# EAGLE board LEDSubMatrixHighDensity_test (EAGLE 9.6.2)
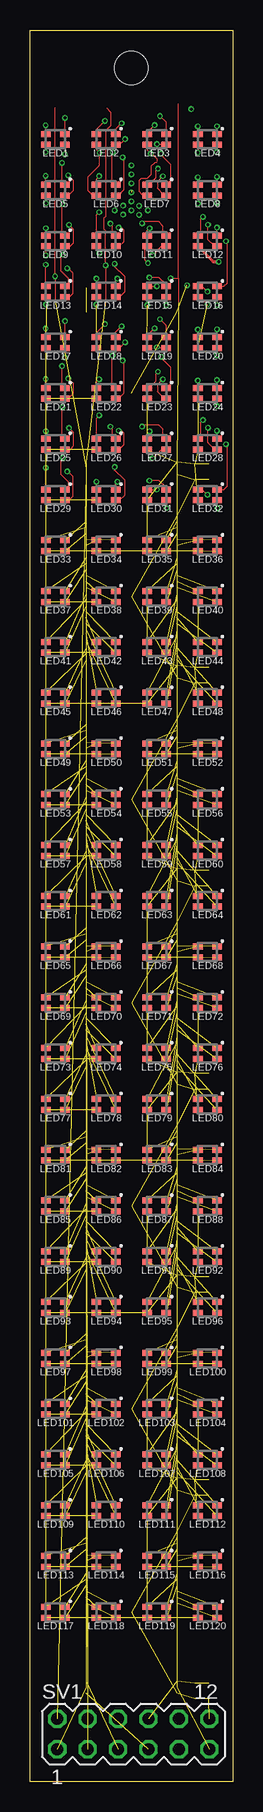
[diagram p2: board, top side]
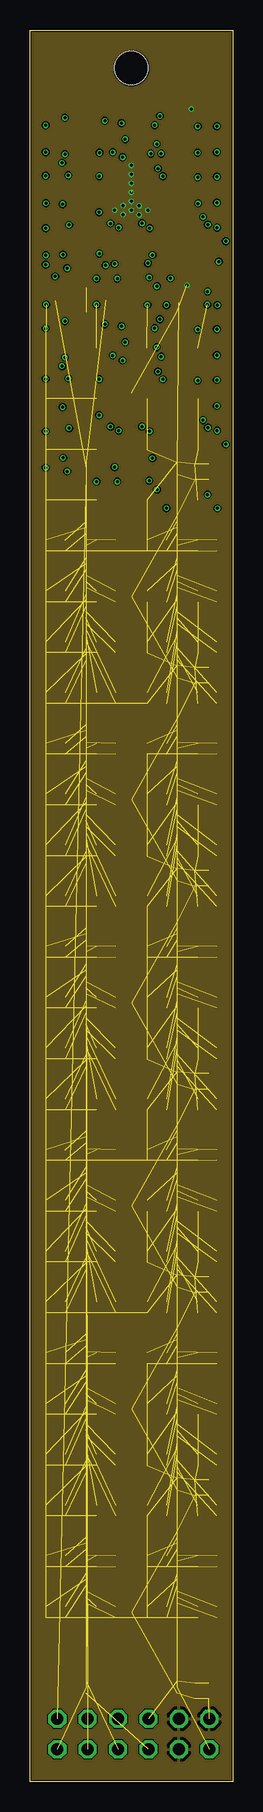
[diagram p3: board, inner layer InnerTop]
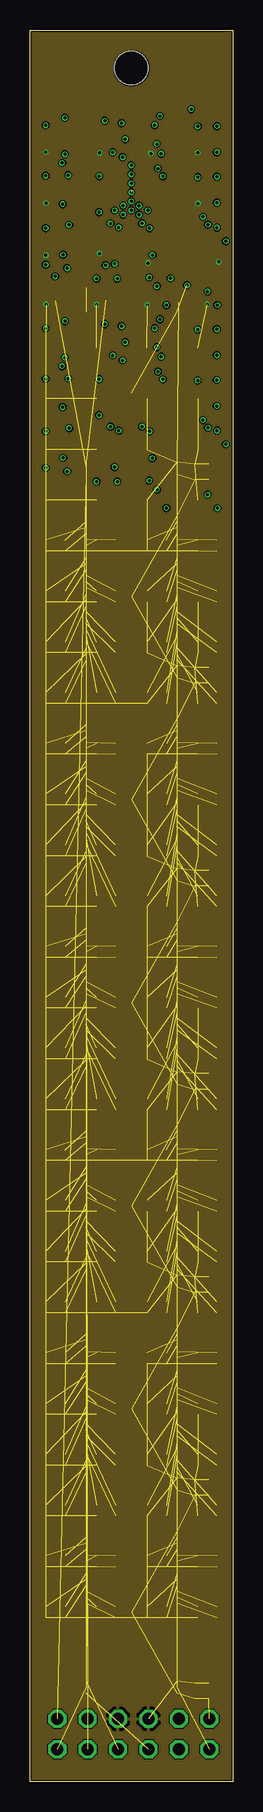
[diagram p4: board, inner layer InnerBottom]
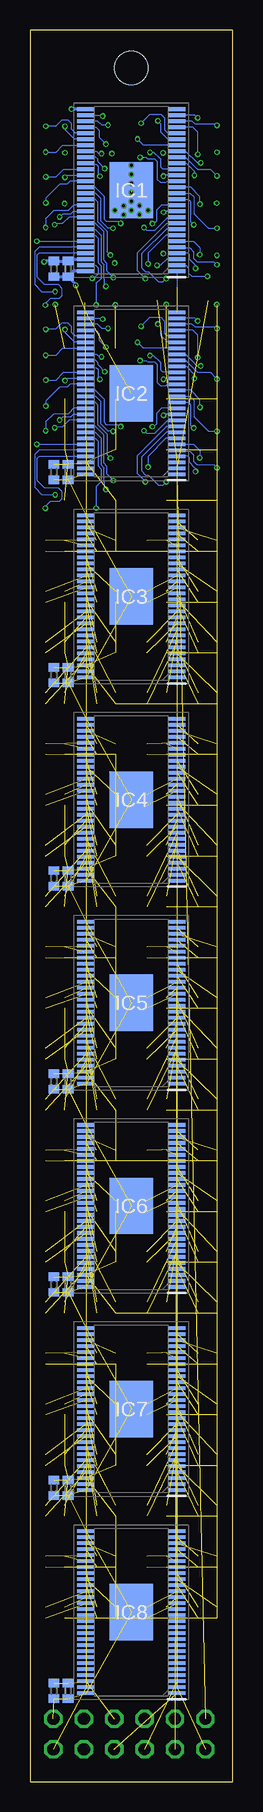
[diagram p5: board, bottom side, seen from below]

Size 16.93 x 146 mm. Coordinates in mm from the lower left corner, seen from the top.
Outline: 0,146 16.93,146 16.93,0 0,0 0,146
Copper layers (1+2*15+16): Top 0.035mm / dielectric 0.2mm / InnerTop 0.0175mm / dielectric 1.065mm / InnerBottom 0.0175mm / dielectric 0.2mm / Bottom 0.035mm
Design rules "jlcpcb_4layer_1oz *": minimum track width 4mil, minimum drill 0.2mm, track to track 4mil, track to pad 0.2mm, pad to pad 5mil, via to via 6mil, smd to smd 5mil, copper to edge 5mil, drill to drill 0.5mm, minimum pad ring 10mil, minimum via ring 0.1mm, stop-mask expansion 4mil, vias tented up to drill 0mil, thermal gap 10mil
Holes 2.75 mm at 8.47,142.82

## Footprints (pad centres in the part's own frame; a part is rotated, then mirrored left to right if it is on the bottom)
C0402 = smd 0.7 x 0.9: 1 -0.65,0; 2 0.65,0
SOP50P810X120-57N = smd 1.475 x 0.3: 1 -3.788,6.75; 2 -3.788,6.25; 3 -3.788,5.75; 4 -3.788,5.25; 5 -3.788,4.75; 6 -3.788,4.25; 7 -3.788,3.75; 8 -3.788,3.25; 9 -3.788,2.75; 10 -3.788,2.25; 11 -3.788,1.75; 12 -3.788,1.25; 13 -3.788,0.75; 14 -3.788,0.25; 15 -3.788,-0.25; 16 -3.788,-0.75; 17 -3.788,-1.25; 18 -3.788,-1.75; 19 -3.788,-2.25; 20 -3.788,-2.75; 21 -3.788,-3.25; 22 -3.788,-3.75; 23 -3.788,-4.25; 24 -3.788,-4.75; 25 -3.788,-5.25; 26 -3.788,-5.75; 27 -3.788,-6.25; 28 -3.788,-6.75; 29 3.788,-6.75; 30 3.788,-6.25; 31 3.788,-5.75; 32 3.788,-5.25; 33 3.788,-4.75; 34 3.788,-4.25; 35 3.788,-3.75; 36 3.788,-3.25; 37 3.788,-2.75; 38 3.788,-2.25; 39 3.788,-1.75; 40 3.788,-1.25; 41 3.788,-0.75; 42 3.788,-0.25; 43 3.788,0.25; 44 3.788,0.75; 45 3.788,1.25; 46 3.788,1.75; 47 3.788,2.25; 48 3.788,2.75; 49 3.788,3.25; 50 3.788,3.75; 51 3.788,4.25; 52 3.788,4.75; 53 3.788,5.25; 54 3.788,5.75; 55 3.788,6.25; 56 3.788,6.75 | smd 3.61 x 4.7: 57 0,0
B38G3RGB = smd 0.8 x 0.5: 1 0.8,0.45; 2 0.8,-0.45; 3 -0.8,-0.45; 4 -0.8,0.45
MA06-2 = drill 1.016 octagon: 1 -6.35,-1.27; 2 -6.35,1.27; 3 -3.81,-1.27; 4 -3.81,1.27; 5 -1.27,-1.27; 6 -1.27,1.27; 7 1.27,-1.27; 8 1.27,1.27; 9 3.81,-1.27; 10 3.81,1.27; 11 6.35,-1.27; 12 6.35,1.27

## Placement (x,y rotation side)
C1  .1uF  [C0402]  13.75,126.09 270 bottom
C1B  10uF  [C0402]  14.93,126.09 270 bottom
C2  .1uF  [C0402]  13.75,109.16 270 bottom
C2B  10uF  [C0402]  14.93,109.16 270 bottom
C3  .1uF  [C0402]  13.75,92.22 270 bottom
C3B  10uF  [C0402]  14.93,92.22 270 bottom
C4  .1uF  [C0402]  13.75,75.29 270 bottom
C4B  10uF  [C0402]  14.93,75.29 270 bottom
C5  .1uF  [C0402]  13.75,58.36 270 bottom
C5B  10uF  [C0402]  14.93,58.36 270 bottom
C6  .1uF  [C0402]  13.75,41.42 270 bottom
C6B  10uF  [C0402]  14.93,41.42 270 bottom
C7  .1uF  [C0402]  13.75,24.49 270 bottom
C7B  10uF  [C0402]  14.93,24.49 270 bottom
C8  .1uF  [C0402]  13.75,7.56 270 bottom
C8B  10uF  [C0402]  14.93,7.56 270 bottom
IC1  TLC5955DCAR  [SOP50P810X120-57N]  8.47,132.65 180 bottom
IC2  TLC5955DCAR  [SOP50P810X120-57N]  8.47,115.72 180 bottom
IC3  TLC5955DCAR  [SOP50P810X120-57N]  8.47,98.78 180 bottom
IC4  TLC5955DCAR  [SOP50P810X120-57N]  8.47,81.85 180 bottom
IC5  TLC5955DCAR  [SOP50P810X120-57N]  8.47,64.92 180 bottom
IC6  TLC5955DCAR  [SOP50P810X120-57N]  8.47,47.98 180 bottom
IC7  TLC5955DCAR  [SOP50P810X120-57N]  8.47,31.05 180 bottom
IC8  TLC5955DCAR  [SOP50P810X120-57N]  8.47,14.12 180 bottom
LED1  B38G3RGB  [B38G3RGB]  2.12,136.88 0 top
LED2  B38G3RGB  [B38G3RGB]  6.35,136.88 0 top
LED3  B38G3RGB  [B38G3RGB]  10.58,136.88 0 top
LED4  B38G3RGB  [B38G3RGB]  14.82,136.88 0 top
LED5  B38G3RGB  [B38G3RGB]  2.12,132.65 0 top
LED6  B38G3RGB  [B38G3RGB]  6.35,132.65 0 top
LED7  B38G3RGB  [B38G3RGB]  10.58,132.65 0 top
LED8  B38G3RGB  [B38G3RGB]  14.82,132.65 0 top
LED9  B38G3RGB  [B38G3RGB]  2.12,128.42 0 top
LED10  B38G3RGB  [B38G3RGB]  6.35,128.42 0 top
LED11  B38G3RGB  [B38G3RGB]  10.58,128.42 0 top
LED12  B38G3RGB  [B38G3RGB]  14.82,128.42 0 top
LED13  B38G3RGB  [B38G3RGB]  2.12,124.18 0 top
LED14  B38G3RGB  [B38G3RGB]  6.35,124.18 0 top
LED15  B38G3RGB  [B38G3RGB]  10.58,124.18 0 top
LED16  B38G3RGB  [B38G3RGB]  14.82,124.18 0 top
LED17  B38G3RGB  [B38G3RGB]  2.12,119.95 0 top
LED18  B38G3RGB  [B38G3RGB]  6.35,119.95 0 top
LED19  B38G3RGB  [B38G3RGB]  10.58,119.95 0 top
LED20  B38G3RGB  [B38G3RGB]  14.82,119.95 0 top
LED21  B38G3RGB  [B38G3RGB]  2.12,115.72 0 top
LED22  B38G3RGB  [B38G3RGB]  6.35,115.72 0 top
LED23  B38G3RGB  [B38G3RGB]  10.58,115.72 0 top
LED24  B38G3RGB  [B38G3RGB]  14.82,115.72 0 top
LED25  B38G3RGB  [B38G3RGB]  2.12,111.48 0 top
LED26  B38G3RGB  [B38G3RGB]  6.35,111.48 0 top
LED27  B38G3RGB  [B38G3RGB]  10.58,111.48 0 top
LED28  B38G3RGB  [B38G3RGB]  14.82,111.48 0 top
LED29  B38G3RGB  [B38G3RGB]  2.12,107.25 0 top
LED30  B38G3RGB  [B38G3RGB]  6.35,107.25 0 top
LED31  B38G3RGB  [B38G3RGB]  10.58,107.25 0 top
LED32  B38G3RGB  [B38G3RGB]  14.82,107.25 0 top
LED33  B38G3RGB  [B38G3RGB]  2.12,103.02 0 top
LED34  B38G3RGB  [B38G3RGB]  6.35,103.02 0 top
LED35  B38G3RGB  [B38G3RGB]  10.58,103.02 0 top
LED36  B38G3RGB  [B38G3RGB]  14.82,103.02 0 top
LED37  B38G3RGB  [B38G3RGB]  2.12,98.78 0 top
LED38  B38G3RGB  [B38G3RGB]  6.35,98.78 0 top
LED39  B38G3RGB  [B38G3RGB]  10.58,98.78 0 top
LED40  B38G3RGB  [B38G3RGB]  14.82,98.78 0 top
LED41  B38G3RGB  [B38G3RGB]  2.12,94.55 0 top
LED42  B38G3RGB  [B38G3RGB]  6.35,94.55 0 top
LED43  B38G3RGB  [B38G3RGB]  10.58,94.55 0 top
LED44  B38G3RGB  [B38G3RGB]  14.82,94.55 0 top
LED45  B38G3RGB  [B38G3RGB]  2.12,90.32 0 top
LED46  B38G3RGB  [B38G3RGB]  6.35,90.32 0 top
LED47  B38G3RGB  [B38G3RGB]  10.58,90.32 0 top
LED48  B38G3RGB  [B38G3RGB]  14.82,90.32 0 top
LED49  B38G3RGB  [B38G3RGB]  2.12,86.08 0 top
LED50  B38G3RGB  [B38G3RGB]  6.35,86.08 0 top
LED51  B38G3RGB  [B38G3RGB]  10.58,86.08 0 top
LED52  B38G3RGB  [B38G3RGB]  14.82,86.08 0 top
LED53  B38G3RGB  [B38G3RGB]  2.12,81.85 0 top
LED54  B38G3RGB  [B38G3RGB]  6.35,81.85 0 top
LED55  B38G3RGB  [B38G3RGB]  10.58,81.85 0 top
LED56  B38G3RGB  [B38G3RGB]  14.82,81.85 0 top
LED57  B38G3RGB  [B38G3RGB]  2.12,77.62 0 top
LED58  B38G3RGB  [B38G3RGB]  6.35,77.62 0 top
LED59  B38G3RGB  [B38G3RGB]  10.58,77.62 0 top
LED60  B38G3RGB  [B38G3RGB]  14.82,77.62 0 top
LED61  B38G3RGB  [B38G3RGB]  2.12,73.38 0 top
LED62  B38G3RGB  [B38G3RGB]  6.35,73.38 0 top
LED63  B38G3RGB  [B38G3RGB]  10.58,73.38 0 top
LED64  B38G3RGB  [B38G3RGB]  14.82,73.38 0 top
LED65  B38G3RGB  [B38G3RGB]  2.12,69.15 0 top
LED66  B38G3RGB  [B38G3RGB]  6.35,69.15 0 top
LED67  B38G3RGB  [B38G3RGB]  10.58,69.15 0 top
LED68  B38G3RGB  [B38G3RGB]  14.82,69.15 0 top
LED69  B38G3RGB  [B38G3RGB]  2.12,64.92 0 top
LED70  B38G3RGB  [B38G3RGB]  6.35,64.92 0 top
LED71  B38G3RGB  [B38G3RGB]  10.58,64.92 0 top
LED72  B38G3RGB  [B38G3RGB]  14.82,64.92 0 top
LED73  B38G3RGB  [B38G3RGB]  2.12,60.68 0 top
LED74  B38G3RGB  [B38G3RGB]  6.35,60.68 0 top
LED75  B38G3RGB  [B38G3RGB]  10.58,60.68 0 top
LED76  B38G3RGB  [B38G3RGB]  14.82,60.68 0 top
LED77  B38G3RGB  [B38G3RGB]  2.12,56.45 0 top
LED78  B38G3RGB  [B38G3RGB]  6.35,56.45 0 top
LED79  B38G3RGB  [B38G3RGB]  10.58,56.45 0 top
LED80  B38G3RGB  [B38G3RGB]  14.82,56.45 0 top
LED81  B38G3RGB  [B38G3RGB]  2.12,52.22 0 top
LED82  B38G3RGB  [B38G3RGB]  6.35,52.22 0 top
LED83  B38G3RGB  [B38G3RGB]  10.58,52.22 0 top
LED84  B38G3RGB  [B38G3RGB]  14.82,52.22 0 top
LED85  B38G3RGB  [B38G3RGB]  2.12,47.98 0 top
LED86  B38G3RGB  [B38G3RGB]  6.35,47.98 0 top
LED87  B38G3RGB  [B38G3RGB]  10.58,47.98 0 top
LED88  B38G3RGB  [B38G3RGB]  14.82,47.98 0 top
LED89  B38G3RGB  [B38G3RGB]  2.12,43.75 0 top
LED90  B38G3RGB  [B38G3RGB]  6.35,43.75 0 top
LED91  B38G3RGB  [B38G3RGB]  10.58,43.75 0 top
LED92  B38G3RGB  [B38G3RGB]  14.82,43.75 0 top
LED93  B38G3RGB  [B38G3RGB]  2.12,39.52 0 top
LED94  B38G3RGB  [B38G3RGB]  6.35,39.52 0 top
LED95  B38G3RGB  [B38G3RGB]  10.58,39.52 0 top
LED96  B38G3RGB  [B38G3RGB]  14.82,39.52 0 top
LED97  B38G3RGB  [B38G3RGB]  2.12,35.28 0 top
LED98  B38G3RGB  [B38G3RGB]  6.35,35.28 0 top
LED99  B38G3RGB  [B38G3RGB]  10.58,35.28 0 top
LED100  B38G3RGB  [B38G3RGB]  14.82,35.28 0 top
LED101  B38G3RGB  [B38G3RGB]  2.12,31.05 0 top
LED102  B38G3RGB  [B38G3RGB]  6.35,31.05 0 top
LED103  B38G3RGB  [B38G3RGB]  10.58,31.05 0 top
LED104  B38G3RGB  [B38G3RGB]  14.82,31.05 0 top
LED105  B38G3RGB  [B38G3RGB]  2.12,26.82 0 top
LED106  B38G3RGB  [B38G3RGB]  6.35,26.82 0 top
LED107  B38G3RGB  [B38G3RGB]  10.58,26.82 0 top
LED108  B38G3RGB  [B38G3RGB]  14.82,26.82 0 top
LED109  B38G3RGB  [B38G3RGB]  2.12,22.58 0 top
LED110  B38G3RGB  [B38G3RGB]  6.35,22.58 0 top
LED111  B38G3RGB  [B38G3RGB]  10.58,22.58 0 top
LED112  B38G3RGB  [B38G3RGB]  14.82,22.58 0 top
LED113  B38G3RGB  [B38G3RGB]  2.12,18.35 0 top
LED114  B38G3RGB  [B38G3RGB]  6.35,18.35 0 top
LED115  B38G3RGB  [B38G3RGB]  10.58,18.35 0 top
LED116  B38G3RGB  [B38G3RGB]  14.82,18.35 0 top
LED117  B38G3RGB  [B38G3RGB]  2.12,14.12 0 top
LED118  B38G3RGB  [B38G3RGB]  6.35,14.12 0 top
LED119  B38G3RGB  [B38G3RGB]  10.58,14.12 0 top
LED120  B38G3RGB  [B38G3RGB]  14.82,14.12 0 top
SV1  [MA06-2]  8.63,3.95 0 top

## Tracks (layer width: path | path; a pad name or v marks a point on that pad's centre or on a via)
3V3  (via drill 0.25)  (125 unrouted)
  Top 0.102: LED1.3 v1.32,135.81 | LED2.3 5.55,136.03 v5.82,135.76 5.82,134.73 4.87,133.78 4.87,132.6 5.27,132.2 LED6.3 | LED3.3 9.78,136 v10.09,135.7 10.18,135.7 10.65,135.23 10.65,135.04 10.6,134.99 10.47,134.99 10.16,134.68 10.16,133.98 9.83,133.65 9.31,133.65 9.13,133.47 9.13,132.52 9.45,132.2 LED7.3 | LED5.3 1.34,132.18 v1.34,131.56 | LED9.3 1.32,127.24 v1.33,127.22 | LED10.3 5.55,127.61 v5.79,127.36 | v9.85,126.57 9.57,126.85 9.57,127.75 LED11.3 | LED15.3 9.78,123.1 v9.8,123.08 | LED14.3 v5.55,123.12 | LED13.3 1.32,123.14 v1.34,123.12 | v14.81,123.11 14.19,123.73 LED16.3 | LED8.3 14.02,131.56 v14.04,131.54 | LED4.3 14,136.42 v14,135.77
  Top 0.254: LED12.3 15.31,126.68 v15.77,126.68
  Bottom 0.254: IC1.54 13.59,126.9 C1.1 C1B.1 15.7,126.74 v15.77,126.68
  pour InnerBottom: -17,163 34,163 34,-24 17,-24 -17,-24
GND  (via drill 0.25)  (36 unrouted)
  Bottom 0.254: v13.46,139.41 v13.45,139.4 IC1.29 | C1B.2 C1.2 | IC1.56 13.29,125.9 C1.2 | C1.2 13.11,124.8 v13.11,124.72
  other vias: 8.46,134.72 8.46,133.97 8.46,133.22 8.46,132.47 8.46,131.72 8.46,130.97 9.12,131.35 7.79,131.36 7.79,130.61 9.12,130.6 7.07,130.96 9.83,130.96
  pour InnerTop: -16,162 32,162 32,82 32,-14 -16,-14
GSCLK  (via drill 0.25)  (8 unrouted)
  Top 0.102: v11.74,125.29 12.38,125.29 | 12.38,125.29 12.38,123.28 | 12.38,125.29 12.38,139.87
  Bottom 0.102: IC1.55 11.47,126.4 11.24,126.17 11.24,125.66 11.61,125.29 v11.74,125.29
LAT  (via drill 0.25)  (8 unrouted)
  Top 0.102: 6.42,139.47 6.79,139.11 6.79,138.08 6.34,137.64 6.34,130.5 6.19,130.34 6.19,129.4 6.32,129.26 6.32,127.15 6.32,127.14 v6.32,126.38 6.32,123.47
  Bottom 0.102: IC1.3 5.51,126.9 6.03,126.38 v6.32,126.38
N$LEDB1  (via drill 0.25)
  Top 0.102: LED1.2 v2.92,135.64
  Bottom 0.102: v2.92,135.64 2.92,137.5 3.32,137.9 IC1.25
N$LEDB2  (via drill 0.25)
  Top 0.102: v7.96,136.91 7.49,136.43 LED2.2
  Bottom 0.102: IC1.22 7.45,136.4 v7.96,136.91
N$LEDB3  (via drill 0.25)
  Top 0.102: LED3.2 10.65,136.43 v10.59,136.5
  Bottom 0.102: IC1.32 11.42,137.9 11.15,137.63 11.15,137.06 v10.59,136.5
N$LEDB4  (via drill 0.25)
  Top 0.102: LED4.2 v15.62,135.82
  Bottom 0.102: v15.62,135.82 14.77,135.82 14.18,136.4 IC1.35
N$LEDB5  (via drill 0.25)
  Top 0.102: v3.21,133.89 3.6,133.5 3.6,132.62 3.18,132.2 LED5.2
  Bottom 0.102: IC1.19 3.89,134.9 3.21,134.22 v3.21,133.89
N$LEDB6  (via drill 0.25)
  Top 0.102: v7.74,135.39 7.82,135.3 7.82,132.63 7.39,132.2 LED6.2
  Bottom 0.102: v7.74,135.39 7.24,135.39 7.13,135.28 6.53,135.28 6.33,135.08 6.33,133.57 6.04,133.29 5.57,133.29 5.46,133.4 IC1.16
N$LEDB7  (via drill 0.25)
  Top 0.102: LED7.2 11.23,132.2 10.63,132.8 10.63,133.35 v11.09,133.81
  Bottom 0.102: IC1.38 12.15,134.8 11.41,134.8 11.26,134.64 11.26,133.98 v11.09,133.81
N$LEDB8  (via drill 0.25)
  Top 0.102: LED8.2 v15.62,131.6 v15.61,131.6
  Bottom 0.102: IC1.41 13.57,133.4 13.82,133.15 14.46,133.15 15.61,132 v15.61,131.6
N$LEDB9  (via drill 0.25)
  Top 0.102: v3.26,129.76 3.62,129.4 3.62,128.22 3.36,127.97 LED9.2
  Bottom 0.102: IC1.13 3.69,131.9 3.52,131.73 3.52,130.01 v3.26,129.76
N$LEDB10  (via drill 0.25)
  Top 0.102: v7.42,129.54 7.63,129.54 7.8,129.37 7.8,128.31 7.45,127.97 LED10.2
  Bottom 0.102: IC1.10 5.43,130.4 6.51,129.31 7.18,129.31 v7.42,129.54
N$LEDB11  (via drill 0.25)
  Top 0.102: LED11.2 10.99,127.97 10.27,127.25 v10.22,127.25
  Bottom 0.102: v10.22,127.25 10.52,127.54 10.52,129.25 11.26,129.99 11.26,131.64 11.51,131.9 IC1.44
N$LEDB12  (via drill 0.25)
  Top 0.102: LED12.2 15.43,127.97 14.87,128.53 v14.87,129.78
  Bottom 0.102: IC1.47 13.68,130.4 14.2,129.88 14.76,129.88 v14.87,129.78
N$LEDB13  (via drill 0.25)
  Top 0.102: v3.11,126.14 3.19,126.14 3.57,125.76 3.57,124.03 3.28,123.73 LED13.2
  Bottom 0.102: v3.11,126.14 3.11,126.39 3.64,126.91 3.64,127.28 3.75,127.4 IC1.4
N$LEDB14  (via drill 0.25)
  Top 0.102: v7.08,126.5 7.08,126.27 7.88,125.46 7.88,124.14 7.47,123.73 LED14.2
  Bottom 0.102: IC1.7 5.56,128.9 7.08,127.39 v7.08,126.5
N$LEDB15  (via drill 0.25)
  Top 0.102: LED15.2 v11.38,123.09 v11.39,123.08
  Bottom 0.102: v11.39,123.08 11.39,124.88 10.99,125.28 10.99,126.35 11.25,126.6 11.25,128.65 11.5,128.9 IC1.50
N$LEDB16  (via drill 0.25)
  Top 0.102: v15.65,123.06 15.65,123.7 LED16.2
  Bottom 0.102: v15.65,123.06 15.65,123.19 15.19,123.65 14.44,123.65 14.23,123.86 14.23,124.44 14.56,124.77 15.69,124.77 16.31,125.39 16.31,127.25 16.14,127.42 12.28,127.42 IC1.53
N$LEDB17  (via drill 0.25)
  Top 0.102: LED17.2 v2.92,118.71
  Bottom 0.102: v2.92,118.71 2.92,120.56 3.32,120.97 IC2.25
N$LEDB18  (via drill 0.25)
  Top 0.102: v7.96,119.97 7.49,119.5 LED18.2
  Bottom 0.102: IC2.22 7.45,119.47 v7.96,119.97
N$LEDB19  (via drill 0.25)
  Top 0.102: LED19.2 10.65,119.5 v10.59,119.56
  Bottom 0.102: IC2.32 11.42,120.97 11.15,120.7 11.15,120.13 v10.59,119.56
N$LEDB20  (via drill 0.25)
  Top 0.102: LED20.2 v15.62,118.88
  Bottom 0.102: v15.62,118.88 14.77,118.88 14.18,119.47 IC2.35
N$LEDB21  (via drill 0.25)
  Top 0.102: v3.21,116.96 3.6,116.57 3.6,115.69 3.18,115.27 LED21.2
  Bottom 0.102: IC2.19 3.89,117.97 3.21,117.29 v3.21,116.96
N$LEDB22  (via drill 0.25)
  Top 0.102: v7.74,118.45 7.82,118.37 7.82,115.7 7.39,115.27 LED22.2
  Bottom 0.102: v7.74,118.45 7.24,118.45 7.13,118.34 6.53,118.34 6.33,118.14 6.33,116.64 6.04,116.36 5.57,116.36 5.46,116.47 IC2.16
N$LEDB23  (via drill 0.25)
  Top 0.102: LED23.2 11.23,115.27 10.63,115.87 10.63,116.42 v11.09,116.88
  Bottom 0.102: IC2.38 12.15,117.87 11.41,117.87 11.26,117.71 11.26,117.04 v11.09,116.88
N$LEDB24  (via drill 0.25)
  Top 0.102: LED24.2 v15.62,114.67 v15.61,114.66
  Bottom 0.102: IC2.41 13.57,116.47 13.82,116.22 14.46,116.22 15.61,115.07 v15.61,114.66
N$LEDB25  (via drill 0.25)
  Top 0.102: v3.26,112.82 3.62,112.46 3.62,111.29 3.36,111.03 LED25.2
  Bottom 0.102: IC2.13 3.69,114.97 3.52,114.8 3.52,113.08 v3.26,112.82
N$LEDB26  (via drill 0.25)
  Top 0.102: v7.42,112.61 7.63,112.61 7.8,112.44 7.8,111.38 7.45,111.03 LED26.2
  Bottom 0.102: IC2.10 5.43,113.47 6.51,112.38 7.18,112.38 v7.42,112.61
N$LEDB27  (via drill 0.25)
  Top 0.102: LED27.2 10.99,111.03 10.27,110.31 v10.22,110.31
  Bottom 0.102: v10.22,110.31 10.52,110.6 10.52,112.31 11.26,113.06 11.26,114.71 11.51,114.97 IC2.44
N$LEDB28  (via drill 0.25)
  Top 0.102: LED28.2 15.43,111.03 14.87,111.59 v14.87,112.84
  Bottom 0.102: IC2.47 13.68,113.47 14.2,112.94 14.76,112.94 v14.87,112.84
N$LEDB29  (via drill 0.25)
  Top 0.102: v3.11,109.21 3.19,109.21 3.57,108.83 3.57,107.09 3.28,106.8 LED29.2
  Bottom 0.102: v3.11,109.21 3.11,109.45 3.64,109.98 3.64,110.35 3.75,110.47 IC2.4
N$LEDB30  (via drill 0.25)
  Top 0.102: v7.08,109.57 7.08,109.33 7.88,108.53 7.88,107.21 7.47,106.8 LED30.2
  Bottom 0.102: IC2.7 5.56,111.97 7.08,110.45 v7.08,109.57
N$LEDB31  (via drill 0.25)
  Top 0.102: LED31.2 11.38,106.15 v11.39,106.14
  Bottom 0.102: v11.39,106.14 11.39,107.94 10.99,108.35 10.99,109.41 11.25,109.67 11.25,111.72 11.5,111.97 IC2.50
N$LEDB32  (via drill 0.25)
  Top 0.102: v15.65,106.13 15.65,106.77 LED32.2
  Bottom 0.102: v15.65,106.13 15.65,106.26 15.19,106.72 14.44,106.72 14.23,106.93 14.23,107.5 14.56,107.83 15.69,107.83 16.31,108.45 16.31,110.32 16.14,110.49 12.28,110.49 IC2.53
N$LEDB33  (1 unrouted)
N$LEDB34  (1 unrouted)
N$LEDB35  (1 unrouted)
N$LEDB36  (1 unrouted)
N$LEDB37  (1 unrouted)
N$LEDB38  (1 unrouted)
N$LEDB39  (1 unrouted)
N$LEDB40  (1 unrouted)
N$LEDB41  (1 unrouted)
N$LEDB42  (1 unrouted)
N$LEDB43  (1 unrouted)
N$LEDB44  (1 unrouted)
N$LEDB45  (1 unrouted)
N$LEDB46  (1 unrouted)
N$LEDB47  (1 unrouted)
N$LEDB48  (1 unrouted)
N$LEDB49  (1 unrouted)
N$LEDB50  (1 unrouted)
N$LEDB51  (1 unrouted)
N$LEDB52  (1 unrouted)
N$LEDB53  (1 unrouted)
N$LEDB54  (1 unrouted)
N$LEDB55  (1 unrouted)
N$LEDB56  (1 unrouted)
N$LEDB57  (1 unrouted)
N$LEDB58  (1 unrouted)
N$LEDB59  (1 unrouted)
N$LEDB60  (1 unrouted)
N$LEDB61  (1 unrouted)
N$LEDB62  (1 unrouted)
N$LEDB63  (1 unrouted)
N$LEDB64  (1 unrouted)
N$LEDB65  (1 unrouted)
N$LEDB66  (1 unrouted)
N$LEDB67  (1 unrouted)
N$LEDB68  (1 unrouted)
N$LEDB69  (1 unrouted)
N$LEDB70  (1 unrouted)
N$LEDB71  (1 unrouted)
N$LEDB72  (1 unrouted)
N$LEDB73  (1 unrouted)
N$LEDB74  (1 unrouted)
N$LEDB75  (1 unrouted)
N$LEDB76  (1 unrouted)
N$LEDB77  (1 unrouted)
N$LEDB78  (1 unrouted)
N$LEDB79  (1 unrouted)
N$LEDB80  (1 unrouted)
N$LEDB81  (1 unrouted)
N$LEDB82  (1 unrouted)
N$LEDB83  (1 unrouted)
N$LEDB84  (1 unrouted)
N$LEDB85  (1 unrouted)
N$LEDB86  (1 unrouted)
N$LEDB87  (1 unrouted)
N$LEDB88  (1 unrouted)
N$LEDB89  (1 unrouted)
N$LEDB90  (1 unrouted)
N$LEDB91  (1 unrouted)
N$LEDB92  (1 unrouted)
N$LEDB93  (1 unrouted)
N$LEDB94  (1 unrouted)
N$LEDB95  (1 unrouted)
N$LEDB96  (1 unrouted)
N$LEDB97  (1 unrouted)
N$LEDB98  (1 unrouted)
N$LEDB99  (1 unrouted)
N$LEDB100  (1 unrouted)
N$LEDB101  (1 unrouted)
N$LEDB102  (1 unrouted)
N$LEDB103  (1 unrouted)
N$LEDB104  (1 unrouted)
N$LEDB105  (1 unrouted)
N$LEDB106  (1 unrouted)
N$LEDB107  (1 unrouted)
N$LEDB108  (1 unrouted)
N$LEDB109  (1 unrouted)
N$LEDB110  (1 unrouted)
N$LEDB111  (1 unrouted)
N$LEDB112  (1 unrouted)
N$LEDB113  (1 unrouted)
N$LEDB114  (1 unrouted)
N$LEDB115  (1 unrouted)
N$LEDB116  (1 unrouted)
N$LEDB117  (1 unrouted)
N$LEDB118  (1 unrouted)
N$LEDB119  (1 unrouted)
N$LEDB120  (1 unrouted)
N$LEDG1  (via drill 0.25)
  Top 0.102: LED1.1 v2.92,138.67 v2.92,138.68
  Bottom 0.102: v2.92,138.68 3.15,138.9 IC1.27
N$LEDG2  (via drill 0.25)
  Top 0.102: LED2.1 7.15,137.73 v7.65,138.23
  Bottom 0.102: v7.65,138.23 6.9,138.98 6.02,138.98 5.7,138.67 5.7,137.68 5.42,137.4 IC1.24
N$LEDG3  (via drill 0.25)
  Top 0.102: LED3.1 11.38,138.3 v10.85,138.83
  Bottom 0.102: IC1.30 10.92,138.9 v10.85,138.83
N$LEDG4  (via drill 0.25)
  Top 0.102: LED4.1 v15.61,137.98
  Bottom 0.102: IC1.33 13.12,137.4 13.44,137.72 13.44,138.19 13.74,138.49 14.29,138.49 14.8,137.98 v15.61,137.98
N$LEDG5  (via drill 0.25)
  Top 0.102: LED5.1 2.65,133.36 2.65,134.9 v2.67,134.92
  Bottom 0.102: v2.67,134.92 2.96,134.92 3.94,135.9 IC1.21
N$LEDG6  (via drill 0.25)
  Top 0.102: LED6.1 6.82,133.43 6.82,135.71 v6.91,135.81
  Bottom 0.102: IC1.18 5.84,134.4 6.02,134.57 6.02,135.21 6.61,135.81 v6.91,135.81
N$LEDG7  (via drill 0.25)
  Top 0.102: LED7.1 11.74,133.46 11.74,134.83 10.95,135.62 v10.95,135.7
  Bottom 0.102: IC1.36 11.35,135.9 11.15,135.7 v10.95,135.7
N$LEDG8  (via drill 0.25)
  Top 0.102: LED8.1 v15.61,133.76
  Bottom 0.102: v15.61,133.76 14.76,133.76 14.13,134.4 IC1.39
N$LEDG9  (via drill 0.25)
  Top 0.102: v2.73,131.49 2.65,131.41 2.65,129.14 LED9.1
  Bottom 0.102: v2.73,131.49 2.73,132.12 3.5,132.9 IC1.15
N$LEDG10  (via drill 0.25)
  Top 0.102: LED10.1 6.84,129.18 6.84,129.75 v6.72,129.87
  Bottom 0.102: v6.72,129.87 6.58,129.87 6.33,130.12 6.33,131.01 5.94,131.4 IC1.12
N$LEDG11  (via drill 0.25)
  Top 0.102: v9.36,129.88 9.49,130.01 10.75,130.01 11.12,129.64 11.12,129.13 LED11.1
  Bottom 0.102: v9.36,129.88 9.49,130.01 10.53,130.01 10.72,130.2 10.72,132.11 11.51,132.9 IC1.42
N$LEDG12  (via drill 0.25)
  Top 0.102: LED12.1 v15.62,129.53
  Bottom 0.102: IC1.45 13.29,131.4 13.72,130.97 14.93,130.97 15.62,130.28 v15.62,129.53
N$LEDG13  (via drill 0.25)
  Top 0.102: LED13.1 3.19,124.91 3.19,125.3 2.57,125.92 2.57,127.08 v2.76,127.27
  Bottom 0.102: IC1.6 3.29,128.4 2.76,127.86 v2.76,127.27
N$LEDG14  (via drill 0.25)
  Top 0.102: LED14.1 7.15,125.13 v7.3,125.28
  Bottom 0.102: v7.3,125.28 7.96,125.94 7.96,127.45 5.51,129.9 IC1.9
N$LEDG15  (via drill 0.25)
  Top 0.102: LED15.1 11.38,124.77 10.78,125.37 v9.96,125.37
  Bottom 0.102: v9.96,125.37 10.49,125.9 10.49,126.54 10.76,126.81 10.76,129.18 11.48,129.9 IC1.48
N$LEDG16  (via drill 0.25)
  Top 0.102: v16.36,128.4 16.43,128.33 16.43,124.86 16.2,124.63 LED16.1
  Bottom 0.102: v16.36,128.4 IC1.51
N$LEDG17  (via drill 0.25)
  Top 0.102: LED17.1 v2.92,121.74
  Bottom 0.102: v2.92,121.74 3.15,121.97 IC2.27
N$LEDG18  (via drill 0.25)
  Top 0.102: LED18.1 7.15,120.8 v7.65,121.3
  Bottom 0.102: v7.65,121.3 6.9,122.05 6.02,122.05 5.7,121.74 5.7,120.75 5.42,120.47 IC2.24
N$LEDG19  (via drill 0.25)
  Top 0.102: LED19.1 11.38,121.37 v10.85,121.9
  Bottom 0.102: IC2.30 10.92,121.97 v10.85,121.9
N$LEDG20  (via drill 0.25)
  Top 0.102: LED20.1 v15.61,121.05
  Bottom 0.102: IC2.33 13.12,120.47 13.44,120.78 13.44,121.25 13.74,121.56 14.29,121.56 14.8,121.05 v15.61,121.05
N$LEDG21  (via drill 0.25)
  Top 0.102: LED21.1 2.65,116.43 2.65,117.97 v2.67,117.98
  Bottom 0.102: v2.67,117.98 2.96,117.98 3.94,118.97 IC2.21
N$LEDG22  (via drill 0.25)
  Top 0.102: LED22.1 6.82,116.5 6.82,118.78 v6.91,118.87
  Bottom 0.102: IC2.18 5.84,117.47 6.02,117.64 6.02,118.28 6.61,118.87 v6.91,118.87
N$LEDG23  (via drill 0.25)
  Top 0.102: LED23.1 11.74,116.52 11.74,117.9 10.95,118.69 v10.95,118.76
  Bottom 0.102: IC2.36 11.35,118.97 11.15,118.76 v10.95,118.76
N$LEDG24  (via drill 0.25)
  Top 0.102: LED24.1 v15.61,116.83
  Bottom 0.102: v15.61,116.83 14.76,116.83 14.13,117.47 IC2.39
N$LEDG25  (via drill 0.25)
  Top 0.102: v2.73,114.55 2.65,114.47 2.65,112.2 LED25.1
  Bottom 0.102: v2.73,114.55 2.73,115.19 3.5,115.97 IC2.15
N$LEDG26  (via drill 0.25)
  Top 0.102: LED26.1 6.84,112.24 6.84,112.81 v6.72,112.94
  Bottom 0.102: v6.72,112.94 6.58,112.94 6.33,113.19 6.33,114.08 5.94,114.47 IC2.12
N$LEDG27  (via drill 0.25)
  Top 0.102: v9.36,112.95 9.49,113.08 10.75,113.08 11.12,112.71 11.12,112.2 LED27.1
  Bottom 0.102: v9.36,112.95 9.49,113.08 10.53,113.08 10.72,113.27 10.72,115.18 11.51,115.96 IC2.42
N$LEDG28  (via drill 0.25)
  Top 0.102: LED28.1 v15.62,112.59 v15.62,112.6
  Bottom 0.102: IC2.45 13.29,114.47 13.72,114.04 14.93,114.04 15.62,113.35 v15.62,112.6
N$LEDG29  (via drill 0.25)
  Top 0.102: LED29.1 3.19,107.98 3.19,108.37 2.57,108.99 2.57,110.15 v2.76,110.34
  Bottom 0.102: IC2.6 3.29,111.47 2.76,110.93 v2.76,110.34
N$LEDG30  (via drill 0.25)
  Top 0.102: LED30.1 7.15,108.2 v7.3,108.35
  Bottom 0.102: v7.3,108.35 7.96,109.01 7.96,110.52 5.51,112.97 IC2.9
N$LEDG31  (via drill 0.25)
  Top 0.102: LED31.1 11.38,107.84 10.78,108.44 v9.96,108.44
  Bottom 0.102: v9.96,108.44 10.49,108.96 10.49,109.6 10.76,109.88 10.76,112.25 11.48,112.97 IC2.48
N$LEDG32  (via drill 0.25)
  Top 0.102: v16.36,111.46 16.43,111.39 16.43,107.93 16.2,107.7 LED32.1
  Bottom 0.102: v16.36,111.46 v16.36,111.47 IC2.51
N$LEDG33  (1 unrouted)
N$LEDG34  (1 unrouted)
N$LEDG35  (1 unrouted)
N$LEDG36  (1 unrouted)
N$LEDG37  (1 unrouted)
N$LEDG38  (1 unrouted)
N$LEDG39  (1 unrouted)
N$LEDG40  (1 unrouted)
N$LEDG41  (1 unrouted)
N$LEDG42  (1 unrouted)
N$LEDG43  (1 unrouted)
N$LEDG44  (1 unrouted)
N$LEDG45  (1 unrouted)
N$LEDG46  (1 unrouted)
N$LEDG47  (1 unrouted)
N$LEDG48  (1 unrouted)
N$LEDG49  (1 unrouted)
N$LEDG50  (1 unrouted)
N$LEDG51  (1 unrouted)
N$LEDG52  (1 unrouted)
N$LEDG53  (1 unrouted)
N$LEDG54  (1 unrouted)
N$LEDG55  (1 unrouted)
N$LEDG56  (1 unrouted)
N$LEDG57  (1 unrouted)
N$LEDG58  (1 unrouted)
N$LEDG59  (1 unrouted)
N$LEDG60  (1 unrouted)
N$LEDG61  (1 unrouted)
N$LEDG62  (1 unrouted)
N$LEDG63  (1 unrouted)
N$LEDG64  (1 unrouted)
N$LEDG65  (1 unrouted)
N$LEDG66  (1 unrouted)
N$LEDG67  (1 unrouted)
N$LEDG68  (1 unrouted)
N$LEDG69  (1 unrouted)
N$LEDG70  (1 unrouted)
N$LEDG71  (1 unrouted)
N$LEDG72  (1 unrouted)
N$LEDG73  (1 unrouted)
N$LEDG74  (1 unrouted)
N$LEDG75  (1 unrouted)
N$LEDG76  (1 unrouted)
N$LEDG77  (1 unrouted)
N$LEDG78  (1 unrouted)
N$LEDG79  (1 unrouted)
N$LEDG80  (1 unrouted)
N$LEDG81  (1 unrouted)
N$LEDG82  (1 unrouted)
N$LEDG83  (1 unrouted)
N$LEDG84  (1 unrouted)
N$LEDG85  (1 unrouted)
N$LEDG86  (1 unrouted)
N$LEDG87  (1 unrouted)
N$LEDG88  (1 unrouted)
N$LEDG89  (1 unrouted)
N$LEDG90  (1 unrouted)
N$LEDG91  (1 unrouted)
N$LEDG92  (1 unrouted)
N$LEDG93  (1 unrouted)
N$LEDG94  (1 unrouted)
N$LEDG95  (1 unrouted)
N$LEDG96  (1 unrouted)
N$LEDG97  (1 unrouted)
N$LEDG98  (1 unrouted)
N$LEDG99  (1 unrouted)
N$LEDG100  (1 unrouted)
N$LEDG101  (1 unrouted)
N$LEDG102  (1 unrouted)
N$LEDG103  (1 unrouted)
N$LEDG104  (1 unrouted)
N$LEDG105  (1 unrouted)
N$LEDG106  (1 unrouted)
N$LEDG107  (1 unrouted)
N$LEDG108  (1 unrouted)
N$LEDG109  (1 unrouted)
N$LEDG110  (1 unrouted)
N$LEDG111  (1 unrouted)
N$LEDG112  (1 unrouted)
N$LEDG113  (1 unrouted)
N$LEDG114  (1 unrouted)
N$LEDG115  (1 unrouted)
N$LEDG116  (1 unrouted)
N$LEDG117  (1 unrouted)
N$LEDG118  (1 unrouted)
N$LEDG119  (1 unrouted)
N$LEDG120  (1 unrouted)
N$LEDR1  (via drill 0.25)
  Top 0.102: LED1.4 v1.32,138.05 v1.31,138.06
  Bottom 0.102: IC1.26 3.39,138.4 3.14,138.15 1.41,138.15 v1.31,138.06
N$LEDR2  (via drill 0.25)
  Top 0.102: LED2.4 5.55,137.72 v6.26,138.43
  Bottom 0.102: v6.26,138.43 6.02,138.19 6.02,137.5 5.42,136.9 IC1.23
N$LEDR3  (via drill 0.25)
  Top 0.102: LED3.4 9.78,137.44 v10.41,138.07
  Bottom 0.102: IC1.31 11.27,138.4 10.96,138.09 10.43,138.09 v10.41,138.07
N$LEDR4  (via drill 0.25)
  Top 0.102: LED4.4 v14.02,137.96 v14.01,137.96
  Bottom 0.102: IC1.34 13.21,136.9 14.01,137.7 v14.01,137.96
N$LEDR5  (via drill 0.25)
  Top 0.102: LED5.4 v1.32,133.85
  Bottom 0.102: v1.32,133.85 1.83,134.37 2.9,134.37 3.94,135.4 IC1.20
N$LEDR6  (via drill 0.25)
  Top 0.102: LED6.4 5.55,133.58 v5.79,133.82
  Bottom 0.102: IC1.17 5.71,133.9 v5.79,133.82
N$LEDR7  (via drill 0.25)
  Top 0.102: v10.69,134.46 10.49,134.26 10.49,133.63 9.96,133.1 LED7.4
  Bottom 0.102: IC1.37 11.44,135.4 11.26,135.22 11.26,135.02 v10.7,134.46 v10.69,134.46
N$LEDR8  (via drill 0.25)
  Top 0.102: LED8.4 14.01,133.11 v14.01,133.72
  Bottom 0.102: v14.01,133.72 13.82,133.9 IC1.40
N$LEDR9  (via drill 0.25)
  Top 0.102: LED9.4 v1.32,129.48
  Bottom 0.102: IC1.14 3.57,132.4 3.26,132.09 3.26,130.7 2.04,129.48 v1.32,129.48
N$LEDR10  (via drill 0.25)
  Top 0.102: LED10.4 5.55,130.59 v5.78,130.82
  Bottom 0.102: IC1.11 5.69,130.9 v5.78,130.82
N$LEDR11  (via drill 0.25)
  Top 0.102: LED11.4 9.78,129.26 v10,129.48
  Bottom 0.102: IC1.43 11.45,132.4 11,131.95 11,130.07 10.41,129.48 v10,129.48
N$LEDR12  (via drill 0.25)
  Top 0.102: LED12.4 14.24,129.09 14.24,130.21 v14.45,130.42
  Bottom 0.102: v14.45,130.42 14.17,130.7 13.49,130.7 13.29,130.9 IC1.46
N$LEDR13  (via drill 0.25)
  Top 0.102: LED13.4 1.32,126.43 v1.32,126.44
  Bottom 0.102: IC1.5 4.61,127.84 3.59,127.84 3.29,127.53 3.29,126.98 2.99,126.69 1.57,126.69 v1.32,126.44
N$LEDR14  (via drill 0.25)
  Top 0.102: LED14.4 v5.55,125.27 v5.56,125.28
  Bottom 0.102: IC1.8 5.56,129.4 7.62,127.34 7.62,126.18 7.28,125.84 7.04,125.84 6.21,125.01 5.82,125.01 v5.56,125.28
N$LEDR15  (via drill 0.25)
  Top 0.102: LED15.4 v10.59,124.63
  Bottom 0.102: IC1.49 11.51,129.4 11.02,128.91 11.02,126.7 10.74,126.42 10.74,125.27 10.74,124.78 v10.59,124.63
N$LEDR16  (via drill 0.25)
  Top 0.102: v14.83,124.2 14.8,124.2 14.36,124.63 LED16.4
  Bottom 0.102: IC1.52 16.17,127.9 16.55,127.52 16.55,124.81 15.94,124.2 v14.83,124.2
N$LEDR17  (via drill 0.25)
  Top 0.102: LED17.4 v1.32,121.12 v1.31,121.12
  Bottom 0.102: IC2.26 3.39,121.47 3.14,121.21 1.41,121.21 v1.31,121.12
N$LEDR18  (via drill 0.25)
  Top 0.102: LED18.4 5.55,120.79 v6.26,121.49
  Bottom 0.102: v6.26,121.49 6.02,121.26 6.02,120.57 5.42,119.97 IC2.23
N$LEDR19  (via drill 0.25)
  Top 0.102: LED19.4 9.78,120.51 v10.41,121.14
  Bottom 0.102: IC2.31 11.27,121.47 10.96,121.15 10.43,121.15 v10.41,121.14
N$LEDR20  (via drill 0.25)
  Top 0.102: LED20.4 v14.02,121.03 v14.01,121.03
  Bottom 0.102: IC2.34 13.21,119.97 14.01,120.77 v14.01,121.03
N$LEDR21  (via drill 0.25)
  Top 0.102: LED21.4 v1.32,116.91 v1.32,116.92
  Bottom 0.102: v1.32,116.92 1.83,117.43 2.9,117.43 3.94,118.47 IC2.20
N$LEDR22  (via drill 0.25)
  Top 0.102: LED22.4 5.55,116.65 v5.79,116.89
  Bottom 0.102: IC2.17 5.71,116.97 v5.79,116.89
N$LEDR23  (via drill 0.25)
  Top 0.102: v10.69,117.52 10.49,117.33 10.49,116.7 9.96,116.17 LED23.4
  Bottom 0.102: IC2.37 11.44,118.47 11.26,118.29 11.26,118.08 v10.7,117.52 v10.69,117.52
N$LEDR24  (via drill 0.25)
  Top 0.102: LED24.4 14.01,116.18 v14.01,116.78
  Bottom 0.102: v14.01,116.78 13.82,116.97 IC2.40
N$LEDR25  (via drill 0.25)
  Top 0.102: LED25.4 v1.32,112.55
  Bottom 0.102: IC2.14 3.57,115.47 3.26,115.16 3.26,113.77 2.04,112.55 v1.32,112.55
N$LEDR26  (via drill 0.25)
  Top 0.102: LED26.4 5.55,113.66 v5.78,113.88
  Bottom 0.102: IC2.11 5.69,113.97 v5.78,113.88
N$LEDR27  (via drill 0.25)
  Top 0.102: LED27.4 9.78,112.33 v10,112.55
  Bottom 0.102: IC2.43 11.45,115.47 11,115.02 11,113.13 10.41,112.55 v10,112.55
N$LEDR28  (via drill 0.25)
  Top 0.102: LED28.4 14.24,112.16 14.24,113.28 v14.45,113.49
  Bottom 0.102: v14.45,113.49 14.17,113.77 13.49,113.77 13.29,113.97 IC2.46
N$LEDR29  (via drill 0.25)
  Top 0.102: LED29.4 v1.32,109.5
  Bottom 0.102: IC2.5 4.61,110.9 3.59,110.9 3.29,110.6 3.29,110.05 2.99,109.75 1.57,109.75 v1.32,109.5
N$LEDR30  (via drill 0.25)
  Top 0.102: LED30.4 v5.55,108.34 v5.56,108.34
  Bottom 0.102: IC2.8 5.56,112.47 7.62,110.4 7.62,109.25 7.28,108.91 7.04,108.91 6.21,108.08 5.82,108.08 v5.56,108.34
N$LEDR31  (via drill 0.25)
  Top 0.102: LED31.4 v10.59,107.7
  Bottom 0.102: IC2.49 11.51,112.47 11.02,111.97 11.02,109.77 10.74,109.49 10.74,108.34 10.74,107.84 v10.59,107.7
N$LEDR32  (via drill 0.25)
  Top 0.102: v14.83,107.27 14.8,107.27 14.36,107.7 LED32.4
  Bottom 0.102: IC2.52 16.17,110.97 16.55,110.59 16.55,107.88 15.94,107.27 v14.83,107.27
N$LEDR33  (1 unrouted)
N$LEDR34  (1 unrouted)
N$LEDR35  (1 unrouted)
N$LEDR36  (1 unrouted)
N$LEDR37  (1 unrouted)
N$LEDR38  (1 unrouted)
N$LEDR39  (1 unrouted)
N$LEDR40  (1 unrouted)
N$LEDR41  (1 unrouted)
N$LEDR42  (1 unrouted)
N$LEDR43  (1 unrouted)
N$LEDR44  (1 unrouted)
N$LEDR45  (1 unrouted)
N$LEDR46  (1 unrouted)
N$LEDR47  (1 unrouted)
N$LEDR48  (1 unrouted)
N$LEDR49  (1 unrouted)
N$LEDR50  (1 unrouted)
N$LEDR51  (1 unrouted)
N$LEDR52  (1 unrouted)
N$LEDR53  (1 unrouted)
N$LEDR54  (1 unrouted)
N$LEDR55  (1 unrouted)
N$LEDR56  (1 unrouted)
N$LEDR57  (1 unrouted)
N$LEDR58  (1 unrouted)
N$LEDR59  (1 unrouted)
N$LEDR60  (1 unrouted)
N$LEDR61  (1 unrouted)
N$LEDR62  (1 unrouted)
N$LEDR63  (1 unrouted)
N$LEDR64  (1 unrouted)
N$LEDR65  (1 unrouted)
N$LEDR66  (1 unrouted)
N$LEDR67  (1 unrouted)
N$LEDR68  (1 unrouted)
N$LEDR69  (1 unrouted)
N$LEDR70  (1 unrouted)
N$LEDR71  (1 unrouted)
N$LEDR72  (1 unrouted)
N$LEDR73  (1 unrouted)
N$LEDR74  (1 unrouted)
N$LEDR75  (1 unrouted)
N$LEDR76  (1 unrouted)
N$LEDR77  (1 unrouted)
N$LEDR78  (1 unrouted)
N$LEDR79  (1 unrouted)
N$LEDR80  (1 unrouted)
N$LEDR81  (1 unrouted)
N$LEDR82  (1 unrouted)
N$LEDR83  (1 unrouted)
N$LEDR84  (1 unrouted)
N$LEDR85  (1 unrouted)
N$LEDR86  (1 unrouted)
N$LEDR87  (1 unrouted)
N$LEDR88  (1 unrouted)
N$LEDR89  (1 unrouted)
N$LEDR90  (1 unrouted)
N$LEDR91  (1 unrouted)
N$LEDR92  (1 unrouted)
N$LEDR93  (1 unrouted)
N$LEDR94  (1 unrouted)
N$LEDR95  (1 unrouted)
N$LEDR96  (1 unrouted)
N$LEDR97  (1 unrouted)
N$LEDR98  (1 unrouted)
N$LEDR99  (1 unrouted)
N$LEDR100  (1 unrouted)
N$LEDR101  (1 unrouted)
N$LEDR102  (1 unrouted)
N$LEDR103  (1 unrouted)
N$LEDR104  (1 unrouted)
N$LEDR105  (1 unrouted)
N$LEDR106  (1 unrouted)
N$LEDR107  (1 unrouted)
N$LEDR108  (1 unrouted)
N$LEDR109  (1 unrouted)
N$LEDR110  (1 unrouted)
N$LEDR111  (1 unrouted)
N$LEDR112  (1 unrouted)
N$LEDR113  (1 unrouted)
N$LEDR114  (1 unrouted)
N$LEDR115  (1 unrouted)
N$LEDR116  (1 unrouted)
N$LEDR117  (1 unrouted)
N$LEDR118  (1 unrouted)
N$LEDR119  (1 unrouted)
N$LEDR120  (1 unrouted)
SCLK  (via drill 0.25)  (8 unrouted)
  Top 0.102: 2.1,123.45 v2.1,125.45 v2.11,125.46 2.09,125.47 2.09,139.52
  Bottom 0.102: IC1.2 3.93,126.39 3.69,126.15 3.69,125.72 3.42,125.46 v2.11,125.46
SIN_1,2  (1 unrouted)
SIN_3,4  (1 unrouted)
SIN_5,6  (1 unrouted)
SIN_7,8  (1 unrouted)
SOUT2  (1 unrouted)
  Bottom 0.102: IC1.1 4.68,124.53
SOUT4  (1 unrouted)
SOUT6  (1 unrouted)
SOUT8  (1 unrouted)